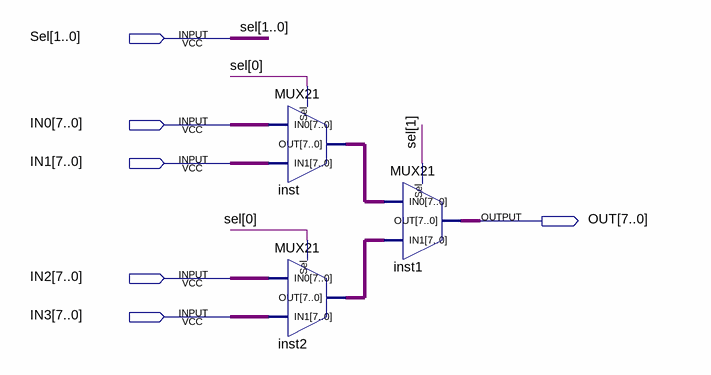
[diagram p0: schematic sheet]
// Quartus schematic MUX41.bdf as structural Verilog: 3 symbols, 6 pins
module MUX41 (
  input  [1:0] Sel,
  input  [7:0] IN0,
  input  [7:0] IN1,
  input  [7:0] IN2,
  input  [7:0] IN3,
  output [7:0] OUT
);

  wire [7:0] inst2_out, inst_out;

  MUX21 inst (.Sel(Sel[0]), .IN0(IN0), .IN1(IN1), .OUT(inst_out));
  MUX21 inst2 (.Sel(Sel[0]), .IN0(IN2), .IN1(IN3), .OUT(inst2_out));
  MUX21 inst1 (.Sel(Sel[1]), .IN0(inst_out), .IN1(inst2_out), .OUT(OUT));
endmodule
